# Altium schematic sheet ZYNQ400-CONDIP.SchDoc
size A3
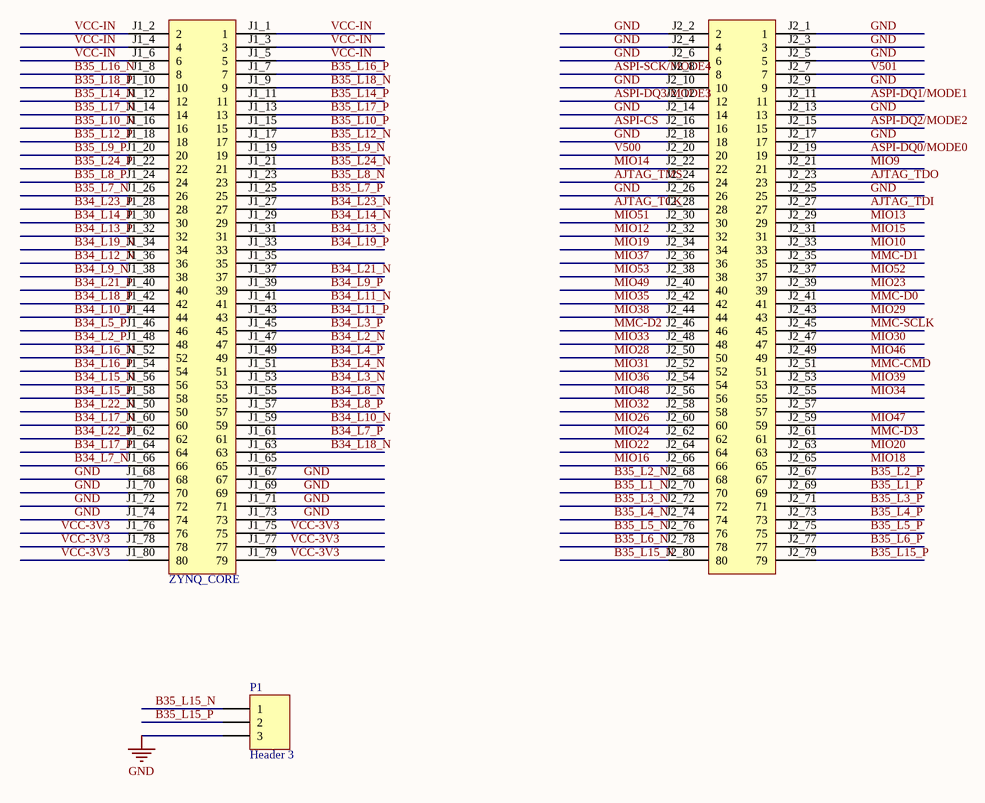
[diagram p0: ZYNQ400-CONDIP.SchDoc]

## Parts
M1  ZYNQ_CORE  [ZYNQ7010&7020]
P1  Header 3  [HDR1X3]

## Nets
GND: M1.J1_67(67) M1.J1_68(68) M1.J1_69(69) M1.J1_70(70) M1.J1_71(71) M1.J1_72(72) M1.J1_73(73) M1.J1_74(74) M1.J2_1(1) M1.J2_2(2) M1.J2_3(3) M1.J2_4(4) M1.J2_5(5) M1.J2_6(6) M1.J2_9(9) M1.J2_10(10) M1.J2_13(13) M1.J2_14(14) M1.J2_17(17) M1.J2_18(18) M1.J2_25(25) M1.J2_26(26) P1.3
AJTAG_TCK: M1.J2_28(28)
AJTAG_TDI: M1.J2_27(27)
AJTAG_TDO: M1.J2_23(23)
AJTAG_TMS: M1.J2_24(24)
ASPI-CS: M1.J2_16(16)
ASPI-DQ0/MODE0: M1.J2_19(19)
ASPI-DQ1/MODE1: M1.J2_11(11)
ASPI-DQ2/MODE2: M1.J2_15(15)
ASPI-DQ3/MODE3: M1.J2_12(12)
ASPI-SCK/MODE4: M1.J2_8(8)
B34_L2_N: M1.J1_47(47)
B34_L2_P: M1.J1_48(48)
B34_L3_N: M1.J1_53(53)
B34_L3_P: M1.J1_45(45)
B34_L4_N: M1.J1_51(51)
B34_L4_P: M1.J1_49(49)
B34_L5_P: M1.J1_46(46)
B34_L7_N: M1.J1_66(66)
B34_L7_P: M1.J1_61(61)
B34_L8_N: M1.J1_55(55)
B34_L8_P: M1.J1_57(57)
B34_L9_N: M1.J1_38(38)
B34_L9_P: M1.J1_39(39)
B34_L10_N: M1.J1_59(59)
B34_L10_P: M1.J1_44(44)
B34_L11_N: M1.J1_41(41)
B34_L11_P: M1.J1_43(43)
B34_L12_N: M1.J1_36(36)
B34_L13_N: M1.J1_31(31)
B34_L13_P: M1.J1_32(32)
B34_L14_N: M1.J1_29(29)
B34_L14_P: M1.J1_30(30)
B34_L15_N: M1.J1_56(56)
B34_L15_P: M1.J1_58(58)
B34_L16_N: M1.J1_52(52)
B34_L16_P: M1.J1_54(54)
B34_L17_N: M1.J1_60(60)
B34_L17_P: M1.J1_64(64)
B34_L18_N: M1.J1_63(63)
B34_L18_P: M1.J1_42(42)
B34_L19_N: M1.J1_34(34)
B34_L19_P: M1.J1_33(33)
B34_L21_N: M1.J1_37(37)
B34_L21_P: M1.J1_40(40)
B34_L22_N: M1.J1_50(50)
B34_L22_P: M1.J1_62(62)
B34_L23_N: M1.J1_27(27)
B34_L23_P: M1.J1_28(28)
B35_L1_N: M1.J2_70(70)
B35_L1_P: M1.J2_69(69)
B35_L2_N: M1.J2_68(68)
B35_L2_P: M1.J2_67(67)
B35_L3_N: M1.J2_72(72)
B35_L3_P: M1.J2_71(71)
B35_L4_N: M1.J2_74(74)
B35_L4_P: M1.J2_73(73)
B35_L5_N: M1.J2_76(76)
B35_L5_P: M1.J2_75(75)
B35_L6_N: M1.J2_78(78)
B35_L6_P: M1.J2_77(77)
B35_L7_N: M1.J1_26(26)
B35_L7_P: M1.J1_25(25)
B35_L8_N: M1.J1_23(23)
B35_L8_P: M1.J1_24(24)
B35_L9_N: M1.J1_19(19)
B35_L9_P: M1.J1_20(20)
B35_L10_N: M1.J1_16(16)
B35_L10_P: M1.J1_15(15)
B35_L12_N: M1.J1_17(17)
B35_L12_P: M1.J1_18(18)
B35_L14_N: M1.J1_12(12)
B35_L14_P: M1.J1_11(11)
B35_L15_N: M1.J2_80(80) P1.1
B35_L15_P: M1.J2_79(79) P1.2
B35_L16_N: M1.J1_8(8)
B35_L16_P: M1.J1_7(7)
B35_L17_N: M1.J1_14(14)
B35_L17_P: M1.J1_13(13)
B35_L18_N: M1.J1_9(9)
B35_L18_P: M1.J1_10(10)
B35_L24_N: M1.J1_21(21)
B35_L24_P: M1.J1_22(22)
MIO9: M1.J2_21(21)
MIO10: M1.J2_33(33)
MIO12: M1.J2_32(32)
MIO13: M1.J2_29(29)
MIO14: M1.J2_22(22)
MIO15: M1.J2_31(31)
MIO16: M1.J2_66(66)
MIO18: M1.J2_65(65)
MIO19: M1.J2_34(34)
MIO20: M1.J2_63(63)
MIO22: M1.J2_64(64)
MIO23: M1.J2_39(39)
MIO24: M1.J2_62(62)
MIO26: M1.J2_60(60)
MIO28: M1.J2_50(50)
MIO29: M1.J2_43(43)
MIO30: M1.J2_47(47)
MIO31: M1.J2_52(52)
MIO32: M1.J2_58(58)
MIO33: M1.J2_48(48)
MIO34: M1.J2_55(55)
MIO35: M1.J2_42(42)
MIO36: M1.J2_54(54)
MIO37: M1.J2_36(36)
MIO38: M1.J2_44(44)
MIO39: M1.J2_53(53)
MIO46: M1.J2_49(49)
MIO47: M1.J2_59(59)
MIO48: M1.J2_56(56)
MIO49: M1.J2_40(40)
MIO51: M1.J2_30(30)
MIO52: M1.J2_37(37)
MIO53: M1.J2_38(38)
MMC-CMD: M1.J2_51(51)
MMC-D0: M1.J2_41(41)
MMC-D1: M1.J2_35(35)
MMC-D2: M1.J2_46(46)
MMC-D3: M1.J2_61(61)
MMC-SCLK: M1.J2_45(45)
V500: M1.J2_20(20)
V501: M1.J2_7(7)
VCC-3V3: M1.J1_75(75) M1.J1_76(76) M1.J1_77(77) M1.J1_78(78) M1.J1_79(79) M1.J1_80(80)
VCC-IN: M1.J1_1(1) M1.J1_2(2) M1.J1_3(3) M1.J1_4(4) M1.J1_5(5) M1.J1_6(6)

Not connected (* = marked no-connect by the designer): M1 J1_35(35) J1_65(65) J2_57(57)

## Library data of the parts
M1 = ZYNQ7010&7020: ZYNQ7010&7020 Core Board
P1 = Header 3: Header, 3-Pin; LatestRevisionDate: 17-Jul-2002; LatestRevisionNote: Re-released for DXP Platform.; Publisher: Altium Limited